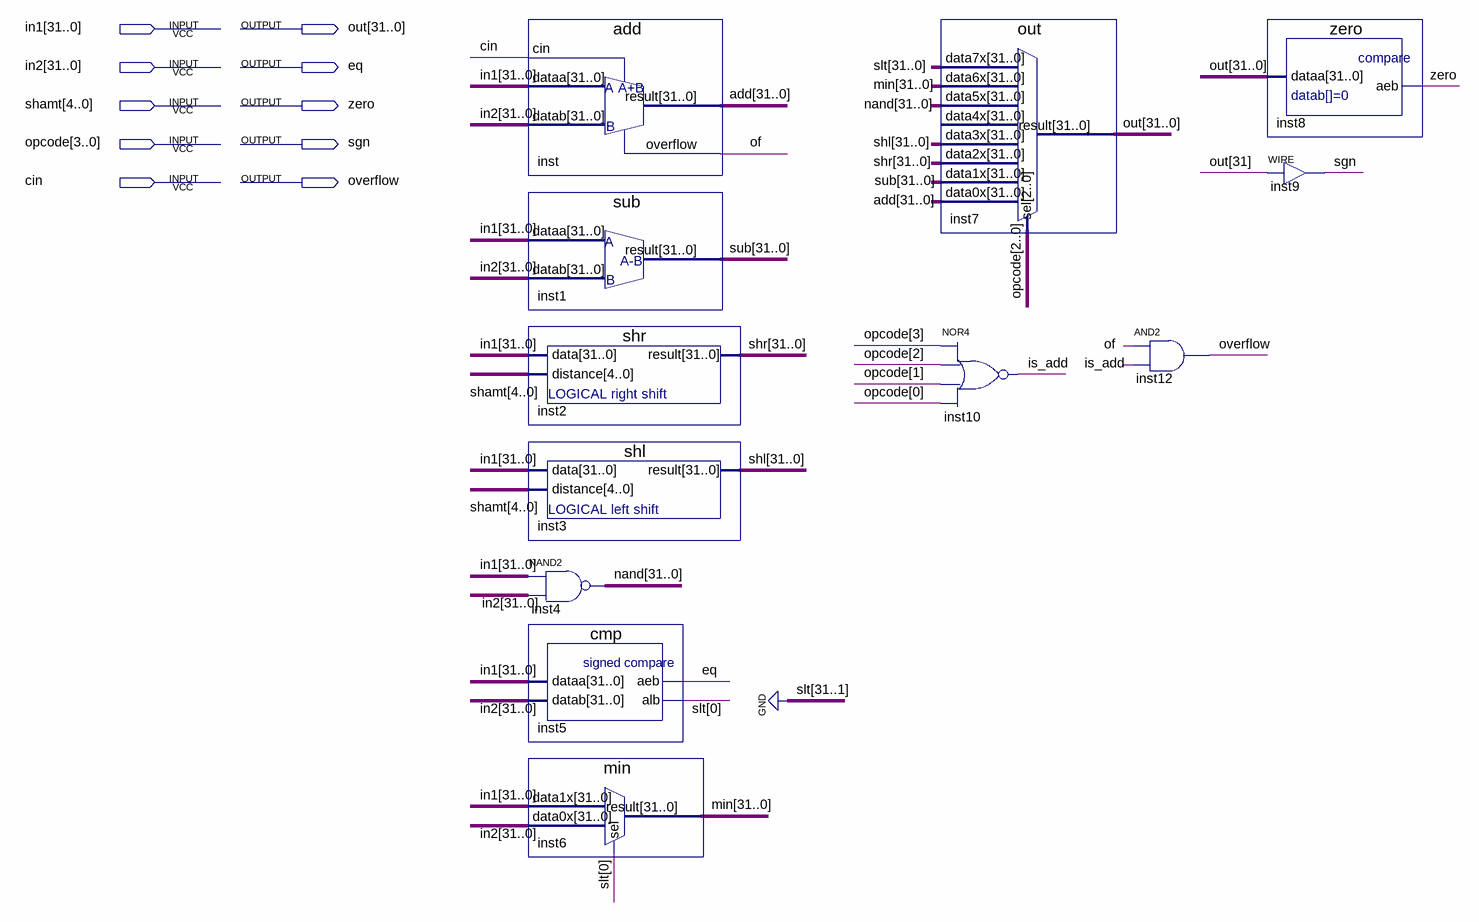
[diagram p0: schematic sheet]
// Quartus schematic ALU.bdf as structural Verilog: 12 symbols, 10 pins
module ALU (
  input  [31:0] in1,
  input  [31:0] in2,
  input  [4:0] shamt,
  input  [3:0] opcode,
  input  cin,
  output [31:0] out,
  output eq,
  output zero,
  output sgn,
  output overflow
);

  wire is_add, of;
  wire [0:0] slt;
  wire [31:0] add, min, \nand , shl, shr, sub;

  add inst (.cin(cin), .dataa(in1), .datab(in2), .result(add), .overflow(of));
  sub inst1 (.dataa(in1), .datab(in2), .result(sub));
  shr inst2 (.data(in1), .distance(shamt), .result(shr));
  shl inst3 (.data(in1), .distance(shamt), .result(shl));
  assign \nand  = ~(in1 & in2);  // NAND2 inst4, 32 bits wide
  cmp inst5 (.dataa(in1), .datab(in2), .aeb(eq), .alb(slt[0]));
  min inst6 (.data1x(in1), .data0x(in2), .sel(slt[0]), .result(min));
  out inst7 (
    .data7x({{31{1'b0}}, slt[0]}), .data6x(min), .data5x(\nand ), .data3x(shl), .data2x(shr), .data1x(sub),
    .data0x(add), .sel(opcode[2:0]), .result(out));  // open: data4x
  nor inst10 (is_add, opcode[3], opcode[2], opcode[1], opcode[0]);
  and inst12 (overflow, of, is_add);
  zero inst8 (.dataa(out), .aeb(zero));
  assign sgn = out[31];  // WIRE inst9
endmodule
